# Altium schematic sheet mboard.SchDoc: MBoard Main
size A4; Organization: heig-vd; Address1: heig-vd; Address2: Route de Cheseaux 1; Address3: 1401 Yverdon-les-Bains; Address4: Suisse; DocumentNumber: 1; Revision: 1.1; SheetNumber: 1; SheetTotal: 12
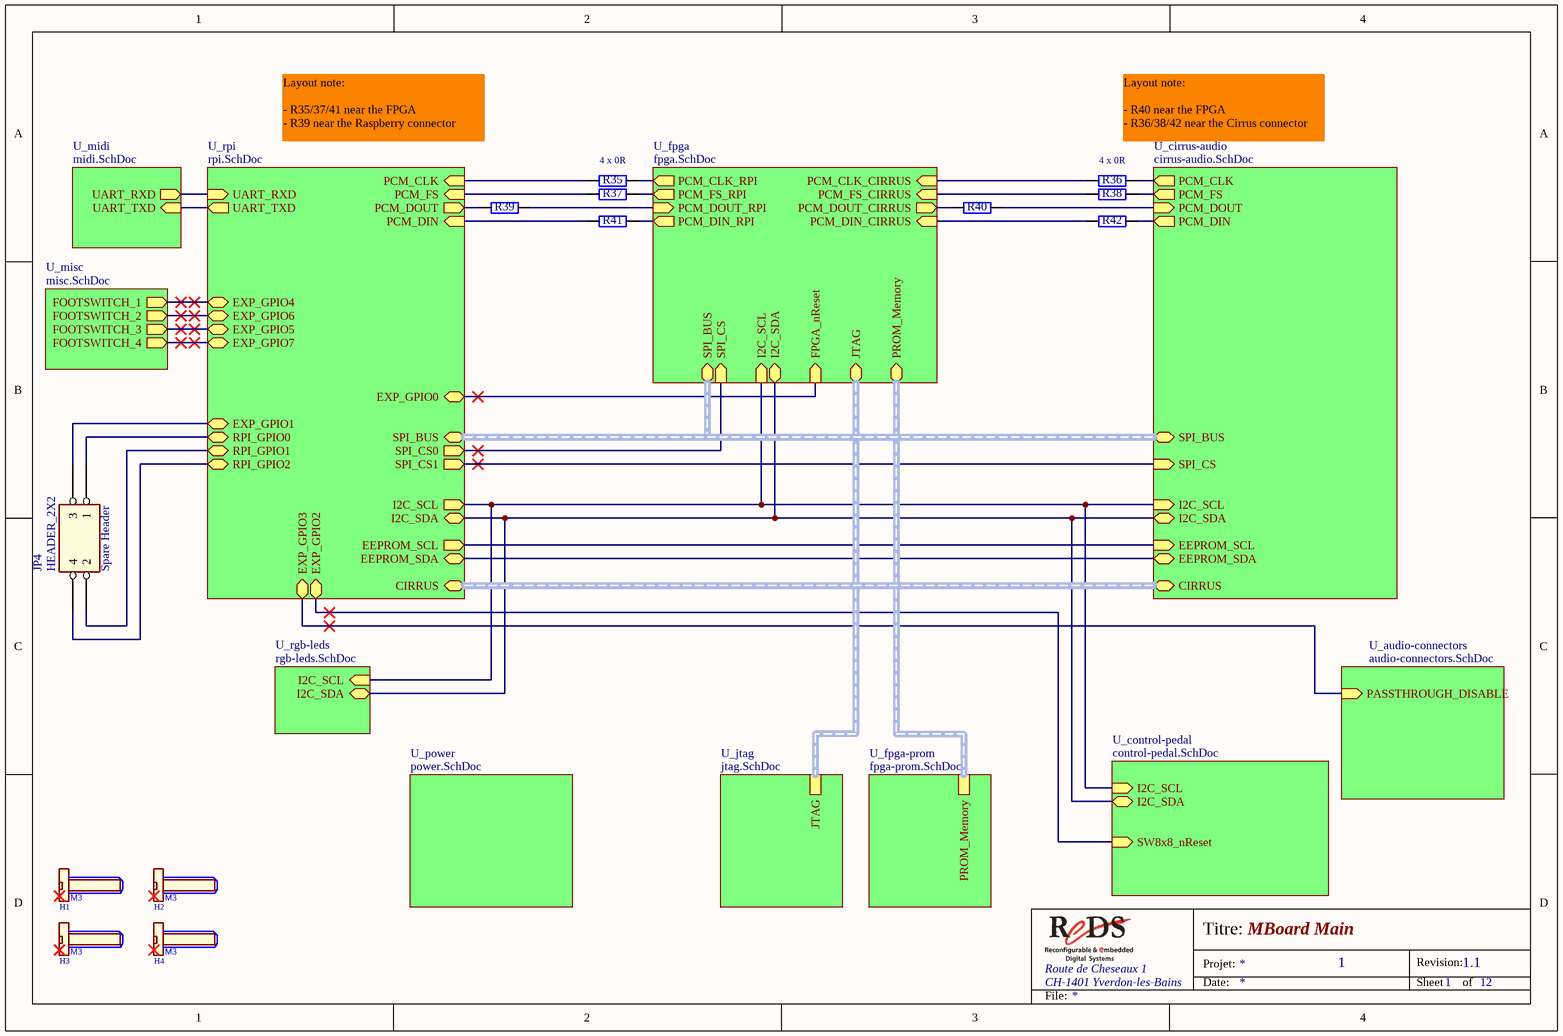
[diagram p0: mboard.SchDoc]

## Parts
H1  M3  [HOLE_3.2MM - No Plated]  (value not drawn)  (no BOM)
H2  M3  [HOLE_3.2MM - No Plated]  (value not drawn)  (no BOM)
H3  M3  [HOLE_3.2MM - No Plated]  (value not drawn)  (no BOM)
H4  M3  [HOLE_3.2MM - No Plated]  (value not drawn)  (no BOM)
JP4  HEADER_2X2  [BLKCON.100/VH/TM2OE/W.200/2]  (no BOM)
R35  0R  [SM/R_0603]  (value not drawn)
R36  0R  [SM/R_0603]  (value not drawn)
R37  0R  [SM/R_0603]  (value not drawn)
R38  0R  [SM/R_0603]  (value not drawn)
R39  0R  [SM/R_0603]  (value not drawn)
R40  0R  [SM/R_0603]  (value not drawn)
R41  0R  [SM/R_0603]  (value not drawn)
R42  0R  [SM/R_0603]  (value not drawn)

## Sub-sheets
U_audio-connectors = audio-connectors.SchDoc: PASSTHROUGH_DISABLE (in)
U_cirrus-audio = cirrus-audio.SchDoc: I2C_SDA (bidir), I2C_SCL (in), SPI_CS (in), PCM_DIN (out), PCM_DOUT (in), EEPROM_SDA (bidir), EEPROM_SCL (in), CIRRUS (harness CIRRUS_CTL), SPI_BUS (harness SPI), PCM_FS (out), PCM_CLK (out)
U_control-pedal = control-pedal.SchDoc: I2C_SDA (bidir), I2C_SCL (in), SW8x8_nReset (in)
U_fpga = fpga.SchDoc: I2C_SDA (bidir), I2C_SCL (in), SPI_CS (in), PCM_DIN_RPI (out), PCM_DOUT_RPI (in), PCM_DIN_CIRRUS (in), PCM_DOUT_CIRRUS (out), FPGA_nReset (in), JTAG (harness JTAG), PROM_Memory (harness PROM_Memory), SPI_BUS (harness SPI), PCM_FS_CIRRUS (in), PCM_CLK_RPI (out), PCM_CLK_CIRRUS (in), PCM_FS_RPI (out)
U_fpga-prom = fpga-prom.SchDoc: PROM_Memory (harness PROM_Memory)
U_jtag = jtag.SchDoc: JTAG (harness JTAG)
U_midi = midi.SchDoc: UART_TXD (in), UART_RXD (out)
U_misc = misc.SchDoc: FOOTSWITCH_1 (out), FOOTSWITCH_2 (out), FOOTSWITCH_4 (out), FOOTSWITCH_3 (out)
U_power = power.SchDoc: no entries
U_rgb-leds = rgb-leds.SchDoc: I2C_SCL (in), I2C_SDA (bidir)
U_rpi = rpi.SchDoc: EEPROM_SDA (bidir), UART_RXD (in), UART_TXD (out), PCM_DOUT (out), I2C_SDA (bidir), I2C_SCL (out), SPI_CS0 (out), SPI_CS1 (out), EEPROM_SCL (out), PCM_DIN (in), EXP_GPIO1 (bidir), EXP_GPIO2 (bidir), EXP_GPIO0 (bidir), EXP_GPIO3 (bidir), EXP_GPIO4 (bidir), EXP_GPIO5 (bidir), EXP_GPIO6 (bidir), EXP_GPIO7 (bidir), SPI_BUS (harness SPI), PCM_CLK (in), PCM_FS (in), CIRRUS (harness CIRRUS_CTL), RPI_GPIO2 (bidir), RPI_GPIO0 (bidir), RPI_GPIO1 (bidir)

## Nets
NetJP4_1: JP4.1 ; sheet U_rpi/RPI_GPIO0
NetJP4_2: JP4.2 ; sheet U_rpi/RPI_GPIO1
NetJP4_3: JP4.3 ; sheet U_rpi/EXP_GPIO1
NetJP4_4: JP4.4 ; sheet U_rpi/RPI_GPIO2
NetR35_1: R35.1 ; sheet U_rpi/PCM_CLK
NetR35_2: R35.2 ; sheet U_fpga/PCM_CLK_RPI
NetR36_1: R36.1 ; sheet U_fpga/PCM_CLK_CIRRUS
NetR36_2: R36.2 ; sheet U_cirrus-audio/PCM_CLK
NetR37_1: R37.1 ; sheet U_rpi/PCM_FS
NetR37_2: R37.2 ; sheet U_fpga/PCM_FS_RPI
NetR38_1: R38.1 ; sheet U_fpga/PCM_FS_CIRRUS
NetR38_2: R38.2 ; sheet U_cirrus-audio/PCM_FS
NetR39_1: R39.1 ; sheet U_rpi/PCM_DOUT
NetR39_2: R39.2 ; sheet U_fpga/PCM_DOUT_RPI
NetR40_1: R40.1 ; sheet U_fpga/PCM_DOUT_CIRRUS
NetR40_2: R40.2 ; sheet U_cirrus-audio/PCM_DOUT
NetR41_1: R41.1 ; sheet U_rpi/PCM_DIN
NetR41_2: R41.2 ; sheet U_fpga/PCM_DIN_RPI
NetR42_1: R42.1 ; sheet U_fpga/PCM_DIN_CIRRUS
NetR42_2: R42.2 ; sheet U_cirrus-audio/PCM_DIN
(unnamed): sheet U_rpi/EEPROM_SDA, sheet U_cirrus-audio/EEPROM_SDA
(unnamed): sheet U_rpi/UART_RXD, sheet U_midi/UART_RXD
(unnamed): sheet U_rpi/UART_TXD, sheet U_midi/UART_TXD
(unnamed): sheet U_rpi/I2C_SDA, sheet U_fpga/I2C_SDA, sheet U_cirrus-audio/I2C_SDA, sheet U_control-pedal/I2C_SDA, sheet U_rgb-leds/I2C_SDA
(unnamed): sheet U_rpi/I2C_SCL, sheet U_fpga/I2C_SCL, sheet U_cirrus-audio/I2C_SCL, sheet U_control-pedal/I2C_SCL, sheet U_rgb-leds/I2C_SCL
(unnamed): sheet U_rpi/SPI_CS0, sheet U_fpga/SPI_CS
(unnamed): sheet U_rpi/SPI_CS1, sheet U_cirrus-audio/SPI_CS
(unnamed): sheet U_rpi/EEPROM_SCL, sheet U_cirrus-audio/EEPROM_SCL
(unnamed): sheet U_rpi/EXP_GPIO2, sheet U_control-pedal/SW8x8_nReset
(unnamed): sheet U_rpi/EXP_GPIO0, sheet U_fpga/FPGA_nReset
(unnamed): sheet U_rpi/EXP_GPIO3, sheet U_audio-connectors/PASSTHROUGH_DISABLE
(unnamed): sheet U_rpi/EXP_GPIO4, sheet U_misc/FOOTSWITCH_1
(unnamed): sheet U_rpi/EXP_GPIO5, sheet U_misc/FOOTSWITCH_3
(unnamed): sheet U_rpi/EXP_GPIO6, sheet U_misc/FOOTSWITCH_2
(unnamed): sheet U_rpi/EXP_GPIO7, sheet U_misc/FOOTSWITCH_4

Not connected (* = marked no-connect by the designer): H1 1(EARTH)*; H2 1(EARTH)*; H3 1(EARTH)*; H4 1(EARTH)*

## Buses and harness runs
harness sheet U_cirrus-audio/CIRRUS = sheet U_rpi/CIRRUS
harness sheet U_cirrus-audio/SPI_BUS = sheet U_fpga/SPI_BUS = sheet U_rpi/SPI_BUS
harness sheet U_fpga-prom/PROM_Memory = sheet U_fpga/PROM_Memory
harness sheet U_fpga/JTAG = sheet U_jtag/JTAG

## Notes on the sheet
- Layout note:
  - R35/37/41 near the FPGA
  - R39 near the Raspberry connector
- (near R35) 4 x 0R
- (near R36) 4 x 0R
- Layout note:
  - R40 near the FPGA
  - R36/38/42 near the Cirrus connector
- (near JP4) Spare Header
- Route de Cheseaux 1
- CH-1401 Yverdon-les-Bains
- Titre:
- Date:
- Projet:
- Revision:
- Sheet
- of
- File:

## Library data of the parts
H1-H4 = 143: Trou de fixation 3.2mm non métalisé pour vis M3; ID: 143; Component Type: Fixation M3; Value: M3; ComponentLink1Description: Datasheet; ComponentLink2Description: Supplier; RoHS Compliant1: False
JP4 = 71: Barrette double 2x2 poles 2.54mm; Manufacturer: TE Connectivity; Manufacturer P/N: 5-826632-0; ID: 71; Connector Type: Barrette 2.54mm; Component Type: Barrette 2.54mm; Supplier 1: Distrelec; Supplier Part Number 1: 122363; ComponentLink1Description: Datasheet; ComponentLink1URL: #https://www.distrelec.ch/ishop/Datasheets/eh826629_draw.pdf#; ComponentLink2Description: Supplier; ComponentLink2URL: https://www.distrelec.ch/barrette-%C3%A0-broches-50-p%C3%B4les-1p-x50/te-connectivity/5-826629-0/122354/fr; RoHS Compliant1: False
R35-R42 = 2128: Résistance 0603 100mW 1% 0R; Manufacturer: VISHAY DRALORIC; Manufacturer P/N: CRCW06030000Z0EA; ID: 2128; Voltage: 75V; Value: 0R; Component Type: Résistance; Power: 100mW; Tolerance: 1%; Supplier 1: Digi-Key; Supplier Part Number 1: 541-0.0GTR-ND; Supplier 2: Mouser; Supplier Part Number 2: 71-CRCW0603-0-E3; RoHS Compliant: True; ComponentLink1Description: Datasheet; ComponentLink1URL: #http://www.mouser.com/ds/2/427/dcrcwe3-109170.pdf#; ComponentLink2Description: Supplier; ComponentLink2URL: #http://www.digikey.fr/product-detail/fr/ERJ-2GE0R00X/P0.0JCT-ND/146726#